# Altium schematic sheet Fans.SchDoc
size A4; Organization: Altium Limited; Address1: L3, 12a Rodborough Rd; Address2: Frenchs Forest; Address3: NSW; Address4: Australia 2086
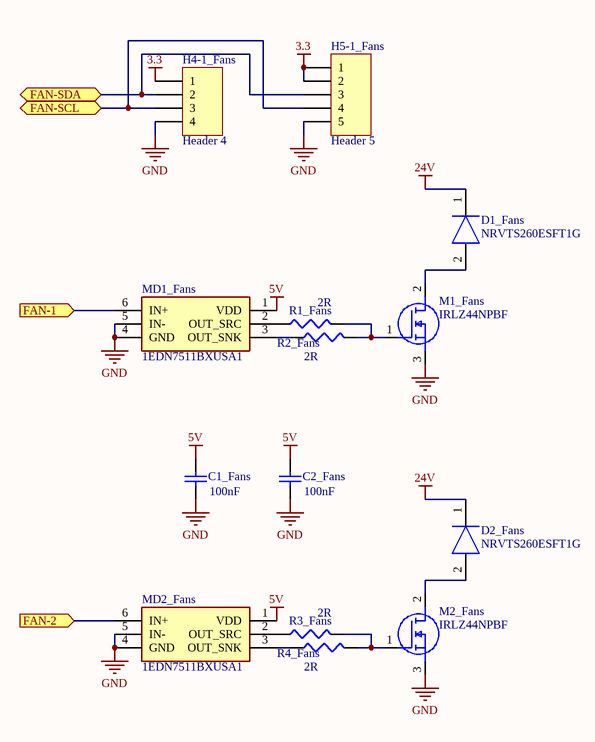
[diagram p0: Fans.SchDoc]

## Parts
C1_Fans  value 100nF  [1608[0603]]  (hidden comment: Cap Semi)
C2_Fans  value 100nF  [1608[0603]]  (hidden comment: Cap Semi)
D1_Fans  NRVTS260ESFT1G  [SODFL3616X98N]
D2_Fans  NRVTS260ESFT1G  [SODFL3616X98N]
H4-1_Fans  Header 4  [HDR1X4]
H5-1_Fans  Header 5  [HDR1X5]
M1_Fans  IRLZ44NPBF  [TO254P469X1042X1967-3P]
M2_Fans  IRLZ44NPBF  [TO254P469X1042X1967-3P]
MD1_Fans  1EDN7511BXUSA1  [SOT95P280X145-6N]
MD2_Fans  1EDN7511BXUSA1  [SOT95P280X145-6N]
R1_Fans  value 2R  [J1-0603]  (hidden comment: Res3)
R2_Fans  value 2R  [J1-0603]  (hidden comment: Res3)
R3_Fans  value 2R  [J1-0603]  (hidden comment: Res3)
R4_Fans  value 2R  [J1-0603]  (hidden comment: Res3)

## Ports
FAN-1, FAN-2, FAN-SCL, FAN-SDA

## Nets
3.3: H4-1_Fans.1 H5-1_Fans.1 H5-1_Fans.2
5V: C1_Fans.2 C2_Fans.2 MD1_Fans.1(VDD) MD2_Fans.1(VDD)
24V: D1_Fans.1(K) D2_Fans.1(K)
GND: C1_Fans.1 C2_Fans.1 H4-1_Fans.4 H5-1_Fans.5 M1_Fans.3(S) M2_Fans.3(S) MD1_Fans.4(GND) MD1_Fans.5(IN-) MD2_Fans.4(GND) MD2_Fans.5(IN-)
FAN-1: MD1_Fans.6(IN+) ; port FAN-1
FAN-2: MD2_Fans.6(IN+) ; port FAN-2
FAN-SCL: H4-1_Fans.3 H5-1_Fans.4 ; port FAN-SCL
FAN-SDA: H4-1_Fans.2 H5-1_Fans.3 ; port FAN-SDA
NetD1_Fans_2: D1_Fans.2(A) M1_Fans.2(D)
NetD2_Fans_2: D2_Fans.2(A) M2_Fans.2(D)
NetM1_Fans_1: M1_Fans.1(G) R1_Fans.2 R2_Fans.2
NetM2_Fans_1: M2_Fans.1(G) R3_Fans.2 R4_Fans.2
NetMD1_Fans_2: MD1_Fans.2(OUT_SRC) R1_Fans.1
NetMD1_Fans_3: MD1_Fans.3(OUT_SNK) R2_Fans.1
NetMD2_Fans_2: MD2_Fans.2(OUT_SRC) R3_Fans.1
NetMD2_Fans_3: MD2_Fans.3(OUT_SNK) R4_Fans.1

## Notes on the sheet
- Title
- Size:
- Date:
- A4
- Number:
- Time:
- Revision:
- Sheet
- of
- File:

## Library data of the parts
C1_Fans C2_Fans = Cap Semi: Capacitor (Semiconductor SIM Model); Published: 8-Jun-2000; LatestRevisionDate: 29-May-2009; LatestRevisionNote: IPC-7351 Footprint Added.; PackageReference: C1206; Publisher: Altium Limited; PackageDescription: Chip Capacitor
D1_Fans D2_Fans = NRVTS260ESFT1G: Diode; Manufacturer_Name: ON Semiconductor; Allied_Number: 70600214; Datasheet Link: http://www.onsemi.com/pub/Collateral/NTS260ESF-D.PDF; Height: 0.98mm; Manufacturer_Part_Number: NRVTS260ESFT1G; Mouser Part Number: 863-NRVTS260ESFT1G; Mouser Price/Stock: https://www.mouser.com/Search/Refine.aspx?Keyword=863-NRVTS260ESFT1G; RS Part Number: 8673243P; RS Price/Stock: http://uk.rs-online.com/web/p/products/8673243P; Allied Price/Stock: http://www.alliedelec.com/on-semiconductor-nrvts260esft1g/70600214/
H4-1_Fans = Header 4: Header, 4-Pin; LatestRevisionDate: 17-Jul-2002; LatestRevisionNote: Re-released for DXP Platform.; Publisher: Altium Limited
H5-1_Fans = Header 5: Header, 5-Pin; LatestRevisionDate: 17-Jul-2002; LatestRevisionNote: Re-released for DXP Platform.; Publisher: Altium Limited
M1_Fans M2_Fans = IRLZ44NPBF: MOSFET (N-Channel); Manufacturer_Name: Infineon; Allied_Number: 70017121; Datasheet Link: https://www.mouser.co.uk/datasheet/2/196/irlz44npbf-1228134.pdf; Height: 4.69mm; Manufacturer_Part_Number: IRLZ44NPBF; Mouser Part Number: 942-IRLZ44NPBF; Mouser Price/Stock: https://www.mouser.com/Search/Refine.aspx?Keyword=942-IRLZ44NPBF; RS Part Number: 5410086P; RS Price/Stock: http://uk.rs-online.com/web/p/products/5410086P; Allied Price/Stock: https://www.alliedelec.com/infineon-irlz44npbf/70017121/
MD1_Fans MD2_Fans = 1EDN7511BXUSA1: Integrated Circuit; Manufacturer_Name: Infineon; Datasheet Link: https://componentsearchengine.com/Datasheets/1/1EDN7511BXUSA1.pdf; Height: 1.45mm; Manufacturer_Part_Number: 1EDN7511BXUSA1; Mouser Part Number: 726-1EDN7511BXUSA1; Mouser Price/Stock: https://www.mouser.com/Search/Refine.aspx?Keyword=726-1EDN7511BXUSA1
R1_Fans R2_Fans R3_Fans R4_Fans = Res3: Resistor; Published: 8-Jun-2000; LatestRevisionDate: 29-May-2009; LatestRevisionNote: IPC-7351 Footprint Added.; PackageReference: J1-0603; Publisher: Altium Limited; PackageDescription: Chip Resistor